# Altium schematic sheet P04_Connectors.SchDoc
size 246 x 182 mm
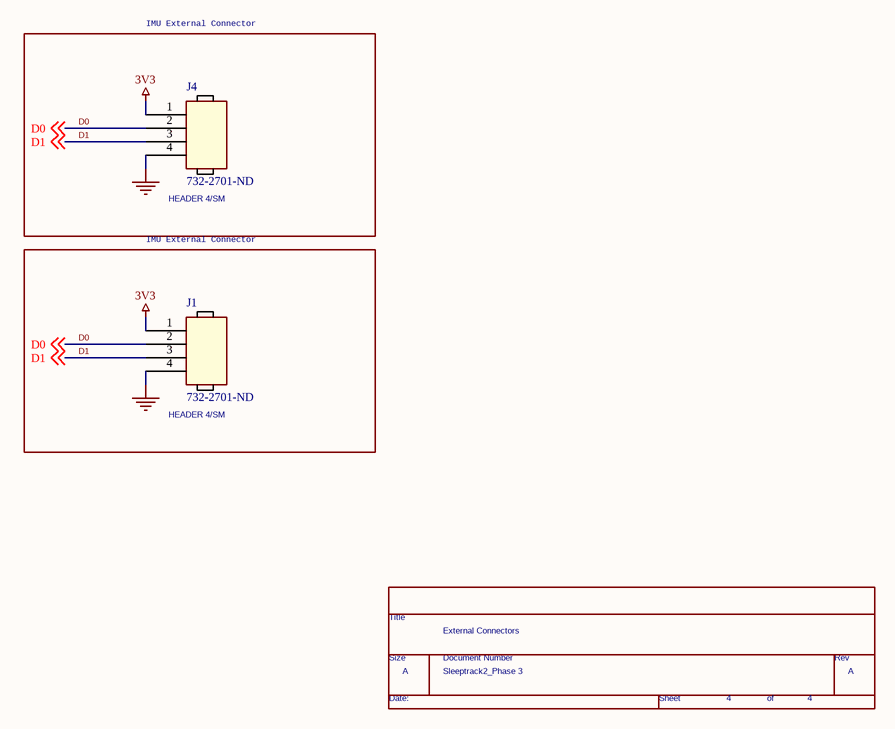
[diagram p0: P04_Connectors.SchDoc]

## Parts
*  Doc: Sleeptrack2_Phase 3  RevCode: A  Title: External Connectors  Page Number: 4  (hidden comment: TitleBlock0)  (graphical)
J1  HEADER 4/SM  Supplier Part Number 1: 732-2701-ND  [61900411021]
J4  HEADER 4/SM  Supplier Part Number 1: 732-2701-ND  [61900411021]

## Blocks framed on the sheet
IMU External Connector: J4
IMU External Connector: J1

## Nets
3V3: J1.1 J4.1
GND: J1.4 J4.4
D0: J1.2 J4.2 ; off-sheet D0
D1: J1.3 J4.3 ; off-sheet D1

## Notes on the sheet
- (in symbol TitleBlock0) Title; Size; Document Number; Rev; Date:; Sheet; of

## Library data of the parts
J1 J4 = HEADER 4/SM: 61900411021; Manufacturer: Wurth Electronics Inc.; Shrouding: Shrouded - 1 Wall; Material Flammability Rating: UL94 V-0; Description: HEADER 4POS PIN R/A 2.54MM T/H; Style: Board to Cable/Wire; Pitch - Mating: 0.100" (2.54mm); Current Rating: 3A; Voltage Rating: 250V; Number of Positions Loaded: All; Number of Positions: 4; Contact Length - Post: 0.134" (3.40mm); Contact Length - Mating: 0.300" (7.62mm); Supplier 1: Digi-Key; Connector Type: Header; Operating Temperature: -40°C ~ 105°C; Contact Type: Male Pin; Features: -; Contact Finish - Post: Tin; Manufacturer Part Number: 61900411021; Category: Connectors, Interconnects; Fastening Type: Friction Lock; Insulation Color: Beige; Insulation Material: Polyamide (PA66), Nylon 6/6; Contact Shape: Square; Contact Finish - Mating: Tin; Contact Finish Thickness - Mating: -; Number of Rows: 1; Packaging: Bulk; Supplier: Digi-Key; Ingress Protection: -; Insulation Height: 0.228" (5.80mm); Termination: Solder; Mated Stacking Heights: -; Applications: -; Overall Contact Length: -; Row Spacing - Mating: -; Part Status: Active; Contact Finish Thickness - Post: -; Mounting Type: Through Hole, Right Angle; RoHS: RoHS Compliant; Contact Material: Copper Alloy
* = TitleBlock0: Page Create Date: March  8, 1995; Page Size: A; Page Count: 4